# Altium schematic sheet usb_breakout_rev_1.SchDoc
size A
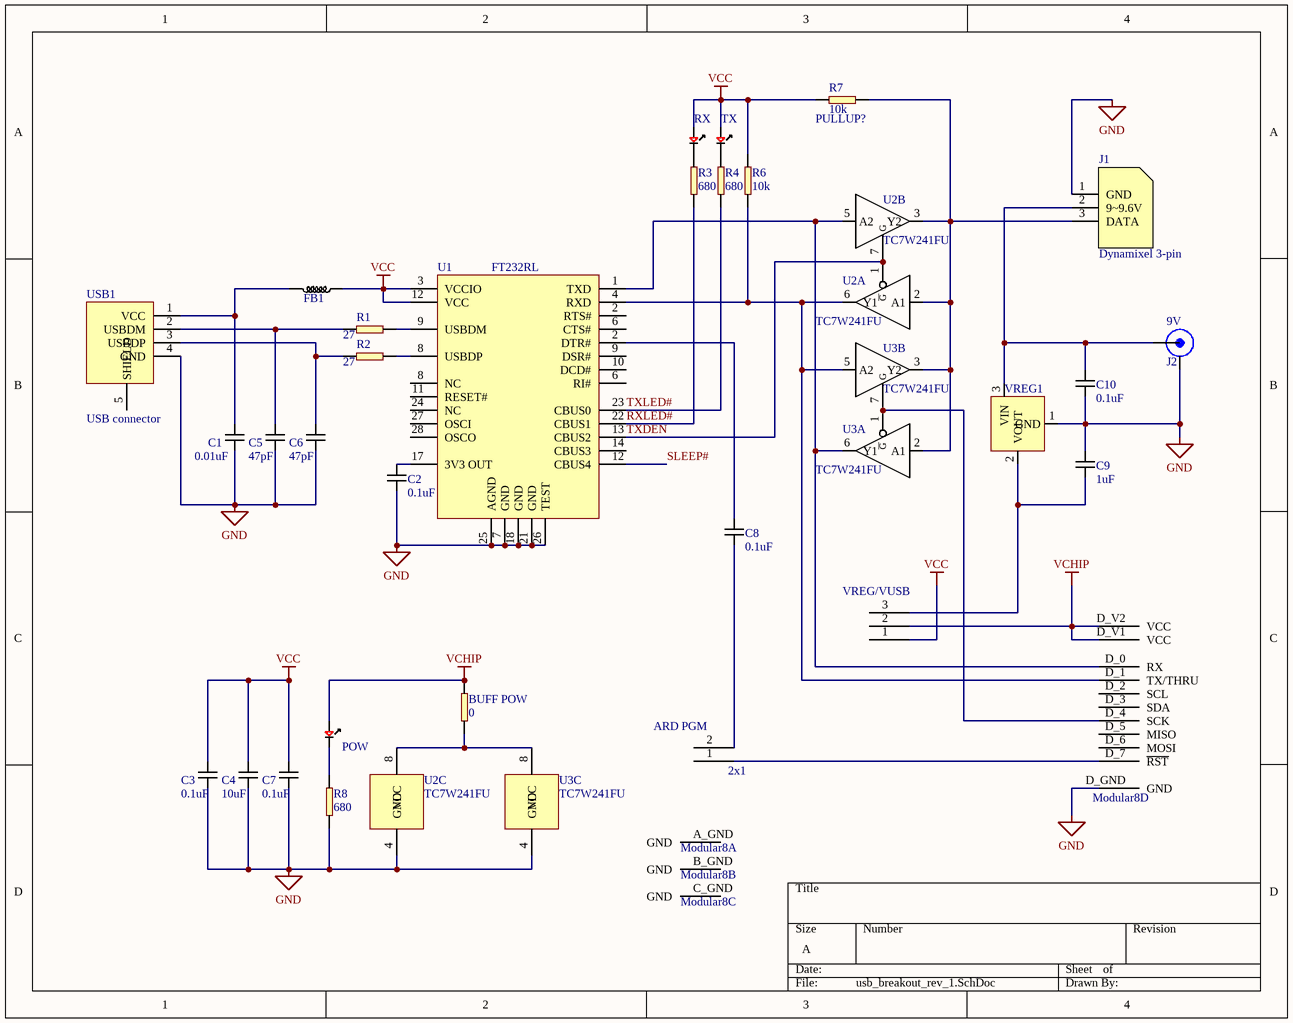
[diagram p0: usb_breakout_rev_1.SchDoc]

## Parts
ARD_PGM  2x1  [2x1 THRU HOLES 0.1" PITCH]
BUFF_POW  R: 0  [0603]  (hidden comment: R 0)
C1  C: 0.01uF  [0603]  (hidden comment: C 0.01uF 25V)
C2  C: 0.1uF  [0603]  (hidden comment: C 0.1uF 25V)
C3  C: 0.1uF  [0603]  (hidden comment: C 0.1uF 25V)
C4  C: 10uF  [0603]  (hidden comment: C 10uF 25V)
C5  C: 47pF  [0603]  (hidden comment: C 47pF 50V)
C6  C: 47pF  [0603]  (hidden comment: C 47pF 50V)
C7  C: 0.1uF  [0603]  (hidden comment: C 0.1uF 25V)
C8  C: 0.1uF  [0603]  (hidden comment: C 0.1uF 25V)
C9  C: 1uF  [0603]  (hidden comment: C 1uF 25V)
C10  C: 0.1uF  [0603]  (hidden comment: C 0.1uF 25V)
FB1  L Ferrite Bead 600ohm  [0603]  (value not drawn)
J1  Dynamixel 3-pin  [DYNAMIXEL 3-PIN]
J2  9V  [DC JACK 2.1MM SMT]
Modular8  modular8_rev2_D  [modular8 edge D flipped]  (value not drawn)  (parts A,B,C,D of 4)
POW  LEDG  [0805 - LED]  (value not drawn)
R1  R: 27  [0603]  (hidden comment: R 27)
R2  R: 27  [0603]  (hidden comment: R 27)
R3  R: 680  [0603]  (hidden comment: R 680)
R4  R: 680  [0603]  (hidden comment: R 680)
R6  R: 10k  [0603]  (hidden comment: R 10k)
R7  PULLUP?  R: 10k  [0603]
R8  R: 680  [0603]  (hidden comment: R 680)
RX  LEDY  [0805 - LED]  (value not drawn)
TX  LEDY  [0805 - LED]  (value not drawn)
U1  FT232RL  [SSOP28]
U2  TC7W241FU  [MSOP8]  (parts A,B,C of 3)
U3  TC7W241FU  [MSOP8]  (parts A,B,C of 3)
USB1  USB connector  [USB MINI]
VREG1  MCP1754ST 5V REG  [SOT-23-3]  (value not drawn)
VREG/VUSB  3x1  [3x1 THRU HOLES 0.1" PITCH]  (value not drawn)

## Nets
GND: C1.2 C2.2 C3.2 C4.2 C5.2 C6.2 C7.2 C9.1 C10.2 J1.1(GND) J2.2(G) Modular8.D_GND(GND) R8.2 U1.7(GND) U1.18(GND) U1.21(GND) U1.25(AGND) U1.26(TEST) U2.4(GND) U3.4(GND) USB1.4(GND) VREG1.1(GND)
VCC: C3.1 C4.1 C7.1 FB1.2 R6.1 R7.1 RX.1(A) TX.1(A) U1.3(VCCIO) U1.12(VCC) VREG/VUSB.1
VCHIP: BUFF_POW.1 Modular8.D_V1(VCC) Modular8.D_V2(VCC) POW.1(A) VREG/VUSB.2
RXLED#: R3.2 U1.22(CBUS1)
SLEEP#: U1.12(CBUS4)
TXDEN: U1.13(CBUS2) U2.1(~{G}) U2.7(G)
TXLED#: R4.2 U1.23(CBUS0)
NetARD_PGM_1: ARD_PGM.1 Modular8.D_7(~{RST})
NetARD_PGM_2: ARD_PGM.2 C8.2
NetBUFF_POW_2: BUFF_POW.2 U2.8(VCC) U3.8(VCC)
NetC1_1: C1.1 FB1.1 USB1.1(VCC)
NetC2_1: C2.1 U1.17(3V3_OUT)
NetC5_1: C5.1 R1.1 USB1.2(USBDM)
NetC6_1: C6.1 R2.1 USB1.3(USBDP)
NetC8_1: C8.1 U1.2(RTS#)
NetC9_2: C9.2 VREG1.2(VOUT) VREG/VUSB.3
NetC10_1: C10.1 J1.2(9~9.6V) J2.1(S) VREG1.3(VIN)
NetJ1_3: J1.3(DATA) R7.2 U2.2(A1) U2.3(Y2) U3.2(A1) U3.3(Y2)
NetModular8_D_0: Modular8.D_0(RX) U1.1(TXD) U2.5(A2) U3.6(Y1)
NetModular8_D_1: Modular8.D_1(TX/THRU) R6.2 U1.4(RXD) U2.6(Y1) U3.5(A2)
NetModular8_D_4: Modular8.D_4(SCK) U3.1(~{G}) U3.7(G)
NetPOW_2: POW.2(K) R8.1
NetR1_2: R1.2 U1.9(USBDM)
NetR2_2: R2.2 U1.8(USBDP)
NetR3_1: R3.1 RX.2(K)
NetR4_1: R4.1 TX.2(K)

Not connected (* = marked no-connect by the designer): Modular8 A_GND(GND) B_GND(GND) C_GND(GND) D_2(SCL) D_3(SDA) D_5(MISO) D_6(MOSI); U1 6(CTS#) 10(DCD#) 11(RESET#) 14(CBUS3) 24(NC) 27(OSCI) 28(OSCO); USB1 5(SHIELD)

## Library data of the parts
J2 = SMT 2.1MM DC JACK: Supplier 1: Digi-Key; Supplier Part Number 1: CP-002AHPJCT-ND
R7 = R 10k: Supplier 1: Digi-Key; Supplier Part Number 1: 311-10KGRCT-ND
BUFF_POW = R 0: Supplier 1: Digi-Key; Supplier Part Number 1: RHM0.0GCT-ND
C1 = C 0.01uF 25V: Supplier 1: Digi-Key; Supplier Part Number 1: 1276-1919-1-ND
C2 C3 C7 C8 C10 = C 0.1uF 25V: Supplier 1: Digi-Key; Supplier Part Number 1: 445-1316-1-ND
C4 = C 10uF 25V: Supplier 1: Digi-Key; Supplier Part Number 1: 445-9015-1-ND
C5 C6 = C 47pF 50V: Supplier 1: Digi-Key; Supplier Part Number 1: 1276-1037-1-ND
C9 = C 1uF 25V: Supplier 1: Digi-Key; Supplier Part Number 1: 1276-1858-1-ND
FB1 = L Ferrite Bead 600ohm: Supplier 1: Digi-Key; Supplier Part Number 1: 732-1593-1-ND
J1 = Dynamixel 3-pin: Supplier 1: Digi-Key; Supplier Part Number 1: WM18887-ND
POW = LEDG: Supplier 1: Digi-Key; Supplier Part Number 1: 160-1423-1-ND
R1 R2 = R 27: Supplier 1: Digi-Key; Supplier Part Number 1: 311-27GRCT-ND
R3 R4 R8 = R 680: Supplier 1: Digi-Key; Supplier Part Number 1: 311-680GRCT-ND
R6 = R 10k: Supplier 1: Digi-Key; Supplier Part Number 1: 311-10KGRCT-ND
RX TX = LEDY: Supplier 1: Digi-Key; Supplier Part Number 1: 160-1413-1-ND
U1 = FT232RL: Supplier 1: Digi-Key; Supplier Part Number 1: 768-1007-1-ND
U2 U3 = TC7W241FU: Supplier 1: Digi-Key; Supplier Part Number 1: TC7W241FUTE12LFCT-ND
USB1 = USB connector: Supplier 1: Digi-Key; Supplier Part Number 1: 609-4700-1-ND
VREG1 = MCP1754ST 5V REG: Supplier 1: Digi-Key; Supplier Part Number 1: MCP1754ST-5002E/CBCT-ND; VOUT: 5V